# Altium schematic sheet LFR_Array_v2.0.SchDoc
size A; SheetNumber: 1; SheetTotal: 1
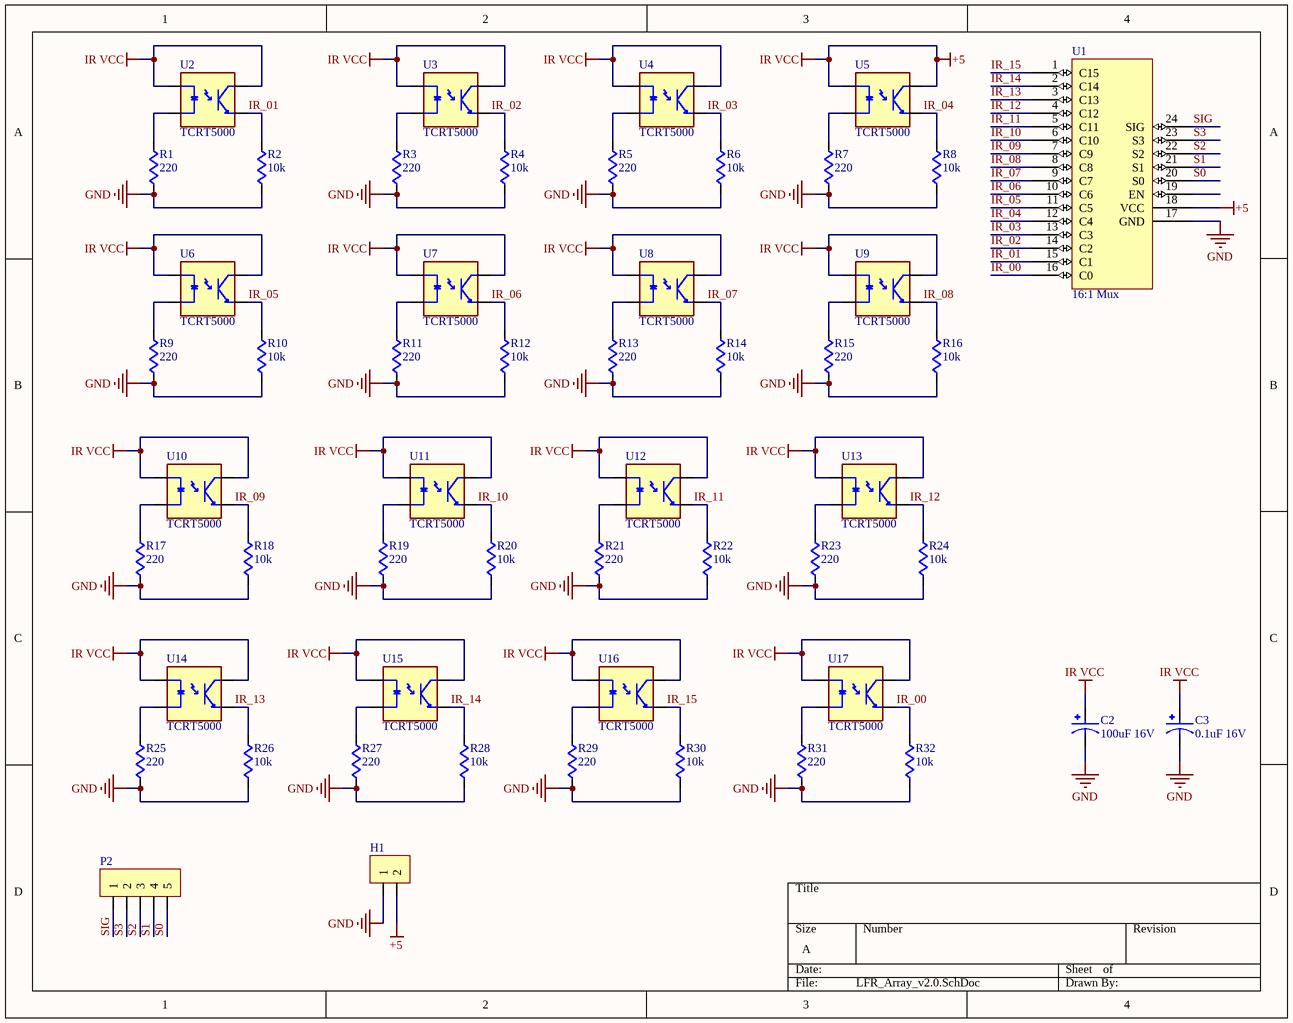
[diagram p0: LFR_Array_v2.0.SchDoc]

## Parts
C2  100uF 16V  [100uF  16V]
C3  0.1uF 16V  [0.1uF 16V]
H1  Header 1x3  [Header 1x2 male CNC]  (value not drawn)
P2  Header 1x5  [Header 1x5 male]  (value not drawn)
R1  220  [1/4W resistor TH CNC]
R2  10k  [1/4W resistor TH CNC]
R3  220  [1/4W resistor TH CNC]
R4  10k  [1/4W resistor TH CNC]
R5  220  [1/4W resistor TH CNC]
R6  10k  [1/4W resistor TH CNC]
R7  220  [1/4W resistor TH CNC]
R8  10k  [1/4W resistor TH CNC]
R9  220  [1/4W resistor TH CNC]
R10  10k  [1/4W resistor TH CNC]
R11  220  [1/4W resistor TH CNC]
R12  10k  [1/4W resistor TH CNC]
R13  220  [1/4W resistor TH CNC]
R14  10k  [1/4W resistor TH CNC]
R15  220  [1/4W resistor TH CNC]
R16  10k  [1/4W resistor TH CNC]
R17  220  [1/4W resistor TH CNC]
R18  10k  [1/4W resistor TH CNC]
R19  220  [1/4W resistor TH CNC]
R20  10k  [1/4W resistor TH CNC]
R21  220  [1/4W resistor TH CNC]
R22  10k  [1/4W resistor TH CNC]
R23  220  [1/4W resistor TH CNC]
R24  10k  [1/4W resistor TH CNC]
R25  220  [1/4W resistor TH CNC]
R26  10k  [1/4W resistor TH CNC]
R27  220  [1/4W resistor TH CNC]
R28  10k  [1/4W resistor TH CNC]
R29  220  [1/4W resistor TH CNC]
R30  10k  [1/4W resistor TH CNC]
R31  220  [1/4W resistor TH CNC]
R32  10k  [1/4W resistor TH CNC]
U1  16:1 Mux  [Mux 16Ch 74HC4067 Module]
U2  TCRT5000  [OPTO_TCRT5000]
U3  TCRT5000  [OPTO_TCRT5000]
U4  TCRT5000  [OPTO_TCRT5000]
U5  TCRT5000  [OPTO_TCRT5000]
U6  TCRT5000  [OPTO_TCRT5000]
U7  TCRT5000  [OPTO_TCRT5000]
U8  TCRT5000  [OPTO_TCRT5000]
U9  TCRT5000  [OPTO_TCRT5000]
U10  TCRT5000  [OPTO_TCRT5000]
U11  TCRT5000  [OPTO_TCRT5000]
U12  TCRT5000  [OPTO_TCRT5000]
U13  TCRT5000  [OPTO_TCRT5000]
U14  TCRT5000  [OPTO_TCRT5000]
U15  TCRT5000  [OPTO_TCRT5000]
U16  TCRT5000  [OPTO_TCRT5000]
U17  TCRT5000  [OPTO_TCRT5000]

## Nets
+5: C2.P C3.P H1.2 U1.18(VCC) U2.A U2.COLL U3.A U3.COLL U4.A U4.COLL U5.A U5.COLL U6.A U6.COLL U7.A U7.COLL U8.A U8.COLL U9.A U9.COLL U10.A U10.COLL U11.A U11.COLL U12.A U12.COLL U13.A U13.COLL U14.A U14.COLL U15.A U15.COLL U16.A U16.COLL U17.A U17.COLL  [also labelled IR VCC]
GND: C2.N C3.N H1.1 R1.1 R2.1 R3.1 R4.1 R5.1 R6.1 R7.1 R8.1 R9.1 R10.1 R11.1 R12.1 R13.1 R14.1 R15.1 R16.1 R17.1 R18.1 R19.1 R20.1 R21.1 R22.1 R23.1 R24.1 R25.1 R26.1 R27.1 R28.1 R29.1 R30.1 R31.1 R32.1 U1.17(GND)
IR_00: R32.2 U1.16(C0) U17.E
IR_01: R2.2 U1.15(C1) U2.E
IR_02: R4.2 U1.14(C2) U3.E
IR_03: R6.2 U1.13(C3) U4.E
IR_04: R8.2 U1.12(C4) U5.E
IR_05: R10.2 U1.11(C5) U6.E
IR_06: R12.2 U1.10(C6) U7.E
IR_07: R14.2 U1.9(C7) U8.E
IR_08: R16.2 U1.8(C8) U9.E
IR_09: R18.2 U1.7(C9) U10.E
IR_10: R20.2 U1.6(C10) U11.E
IR_11: R22.2 U1.5(C11) U12.E
IR_12: R24.2 U1.4(C12) U13.E
IR_13: R26.2 U1.3(C13) U14.E
IR_14: R28.2 U1.2(C14) U15.E
IR_15: R30.2 U1.1(C15) U16.E
S0: P2.5 U1.20(S0)
S1: P2.4 U1.21(S1)
S2: P2.3 U1.22(S2)
S3: P2.2 U1.23(S3)
SIG: P2.1 U1.24(SIG)
NetR1_2: R1.2 U2.CATH
NetR3_2: R3.2 U3.CATH
NetR5_2: R5.2 U4.CATH
NetR7_2: R7.2 U5.CATH
NetR9_2: R9.2 U6.CATH
NetR11_2: R11.2 U7.CATH
NetR13_2: R13.2 U8.CATH
NetR15_2: R15.2 U9.CATH
NetR17_2: R17.2 U10.CATH
NetR19_2: R19.2 U11.CATH
NetR21_2: R21.2 U12.CATH
NetR23_2: R23.2 U13.CATH
NetR25_2: R25.2 U14.CATH
NetR27_2: R27.2 U15.CATH
NetR29_2: R29.2 U16.CATH
NetR31_2: R31.2 U17.CATH

Not connected (* = marked no-connect by the designer): U1 19(EN)

## Library data of the parts
C2 = 100uF 16V: CAP ALUM 100uF 16V RADIAL TH; MP: EEU-FR1E221B; MF: Panasonic Electronic Components; Package: RADIAL-2 Panasonic; Availability: In Stock; Value: *; SnapEDA_Link: https://www.snapeda.com/parts/EEU-FR1E221B/Panasonic/view-part/?ref=snap; Price: None; Check_prices: https://www.snapeda.com/parts/EEU-FR1E221B/Panasonic/view-part/?ref=eda; Purchase-URL: https://pricing.snapeda.com/search/part/EEU-FR1E221B/?ref=eda
C3 = 0.1uF 16V: Cap 0.1uF 16VRADIAL TH; MP: EEU-FR1E221B; MF: Panasonic Electronic Components; Package: RADIAL-2 Panasonic; Availability: In Stock; Value: *; SnapEDA_Link: https://www.snapeda.com/parts/EEU-FR1E221B/Panasonic/view-part/?ref=snap; Price: None; Check_prices: https://www.snapeda.com/parts/EEU-FR1E221B/Panasonic/view-part/?ref=eda; Purchase-URL: https://pricing.snapeda.com/search/part/EEU-FR1E221B/?ref=eda
H1 = Header 1x2
R1 R3 R5 R7 R9 R11 R13 R15 R17 R19 R21 R23 R25 R27 R29 R31 = reg 220 th: Axial Resistor,reg 220 th; Tolerance: 1%; Voltage Rating: 250 V; Resistance: 1 kohm; Power Rating: 250 mW; ComponentLink2Description: Datasheet; RoHSCompliant: true; PackageReference: MFR-25; Case\Package: Axial; Max Operating Temperature: 155 degC; DatasheetVersion: Apr-13; ComponentLink1URL: http://www.yageo.com/; Length: 0.248 inch; ComponentLink2URL: http://www.yageo.com/documents/recent/Yageo%20LR_MFR_2013.pdf; Packaging: Bulk; Package Quantity: 200; PackageDescription: 2-Pin Axial Lead, Dia 2.4 mm, Body Length 6.3 mm; Min Operating Temperature: -55 degC; ComponentLink1Description: Manufacturer URL
R2 R4 R6 R8 R10 R12 R14 R16 R18 R20 R22 R24 R26 R28 R30 R32 = reg 10k th: Axial Resistor,reg 10k th; Tolerance: 1%; Voltage Rating: 250 V; Resistance: 1 kohm; Power Rating: 250 mW; ComponentLink2Description: Datasheet; RoHSCompliant: true; PackageReference: MFR-25; Case\Package: Axial; Max Operating Temperature: 155 degC; DatasheetVersion: Apr-13; ComponentLink1URL: http://www.yageo.com/; Length: 0.248 inch; ComponentLink2URL: http://www.yageo.com/documents/recent/Yageo%20LR_MFR_2013.pdf; Packaging: Bulk; Package Quantity: 200; PackageDescription: 2-Pin Axial Lead, Dia 2.4 mm, Body Length 6.3 mm; Min Operating Temperature: -55 degC; ComponentLink1Description: Manufacturer URL
U1 = Mux 16Ch 74HC4067 Module
U2-U17 = TCRT5000: 950 nm 60 mA Through Hole Reflective Optical Sensor with Transistor Output; Availability: Unavailable; MP: TCRT5000; Value: *; Price: None; Package: None